# Altium schematic sheet Felini.SchDoc
size A0; SheetNumber: 1; SheetTotal: 1
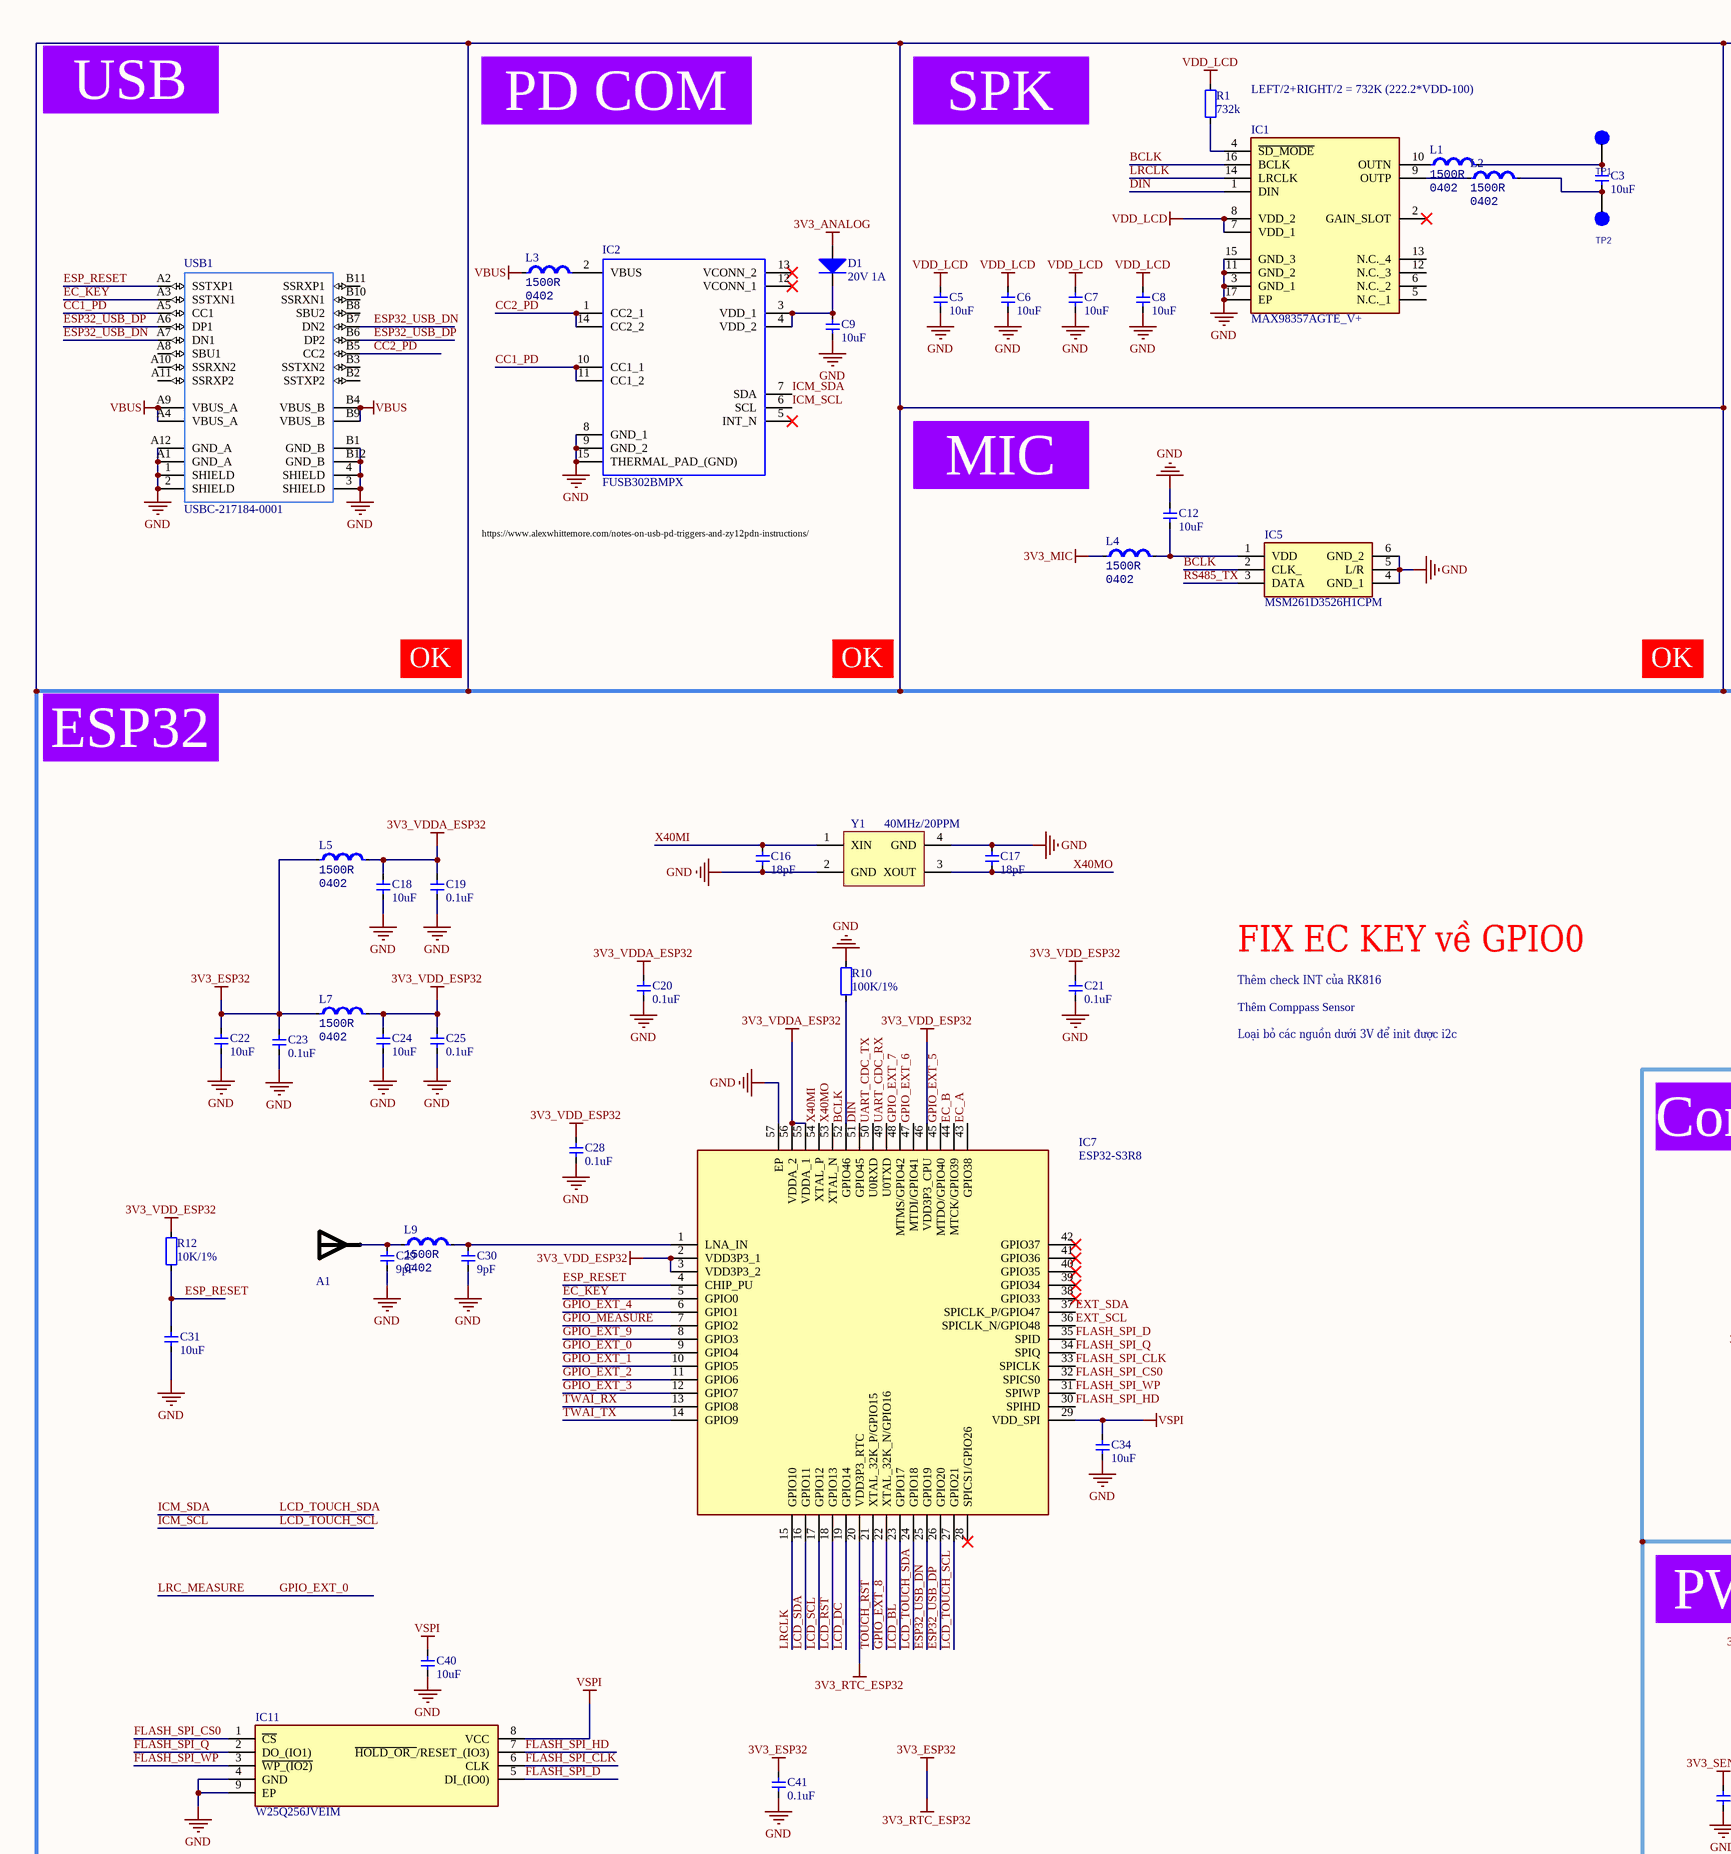
[diagram p0: Felini.SchDoc, top left]
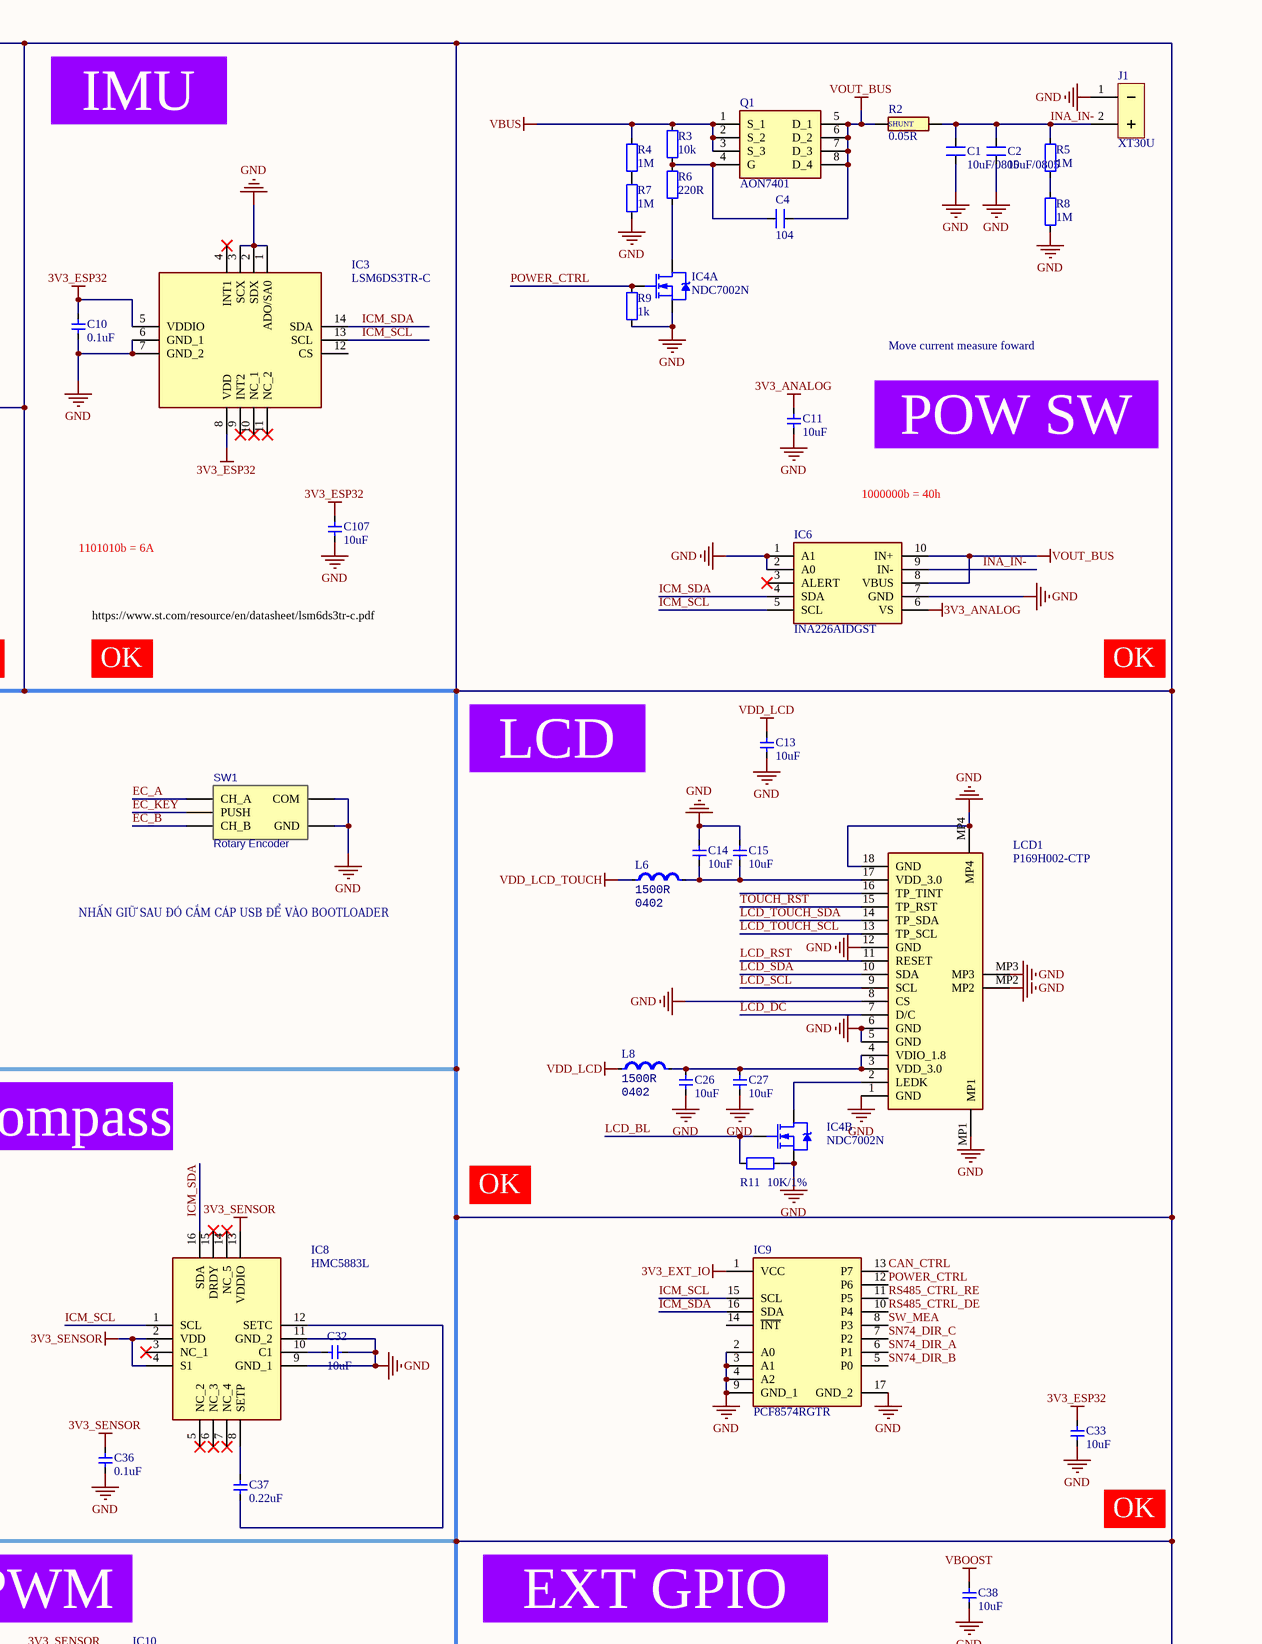
[diagram p1: Felini.SchDoc, top right]
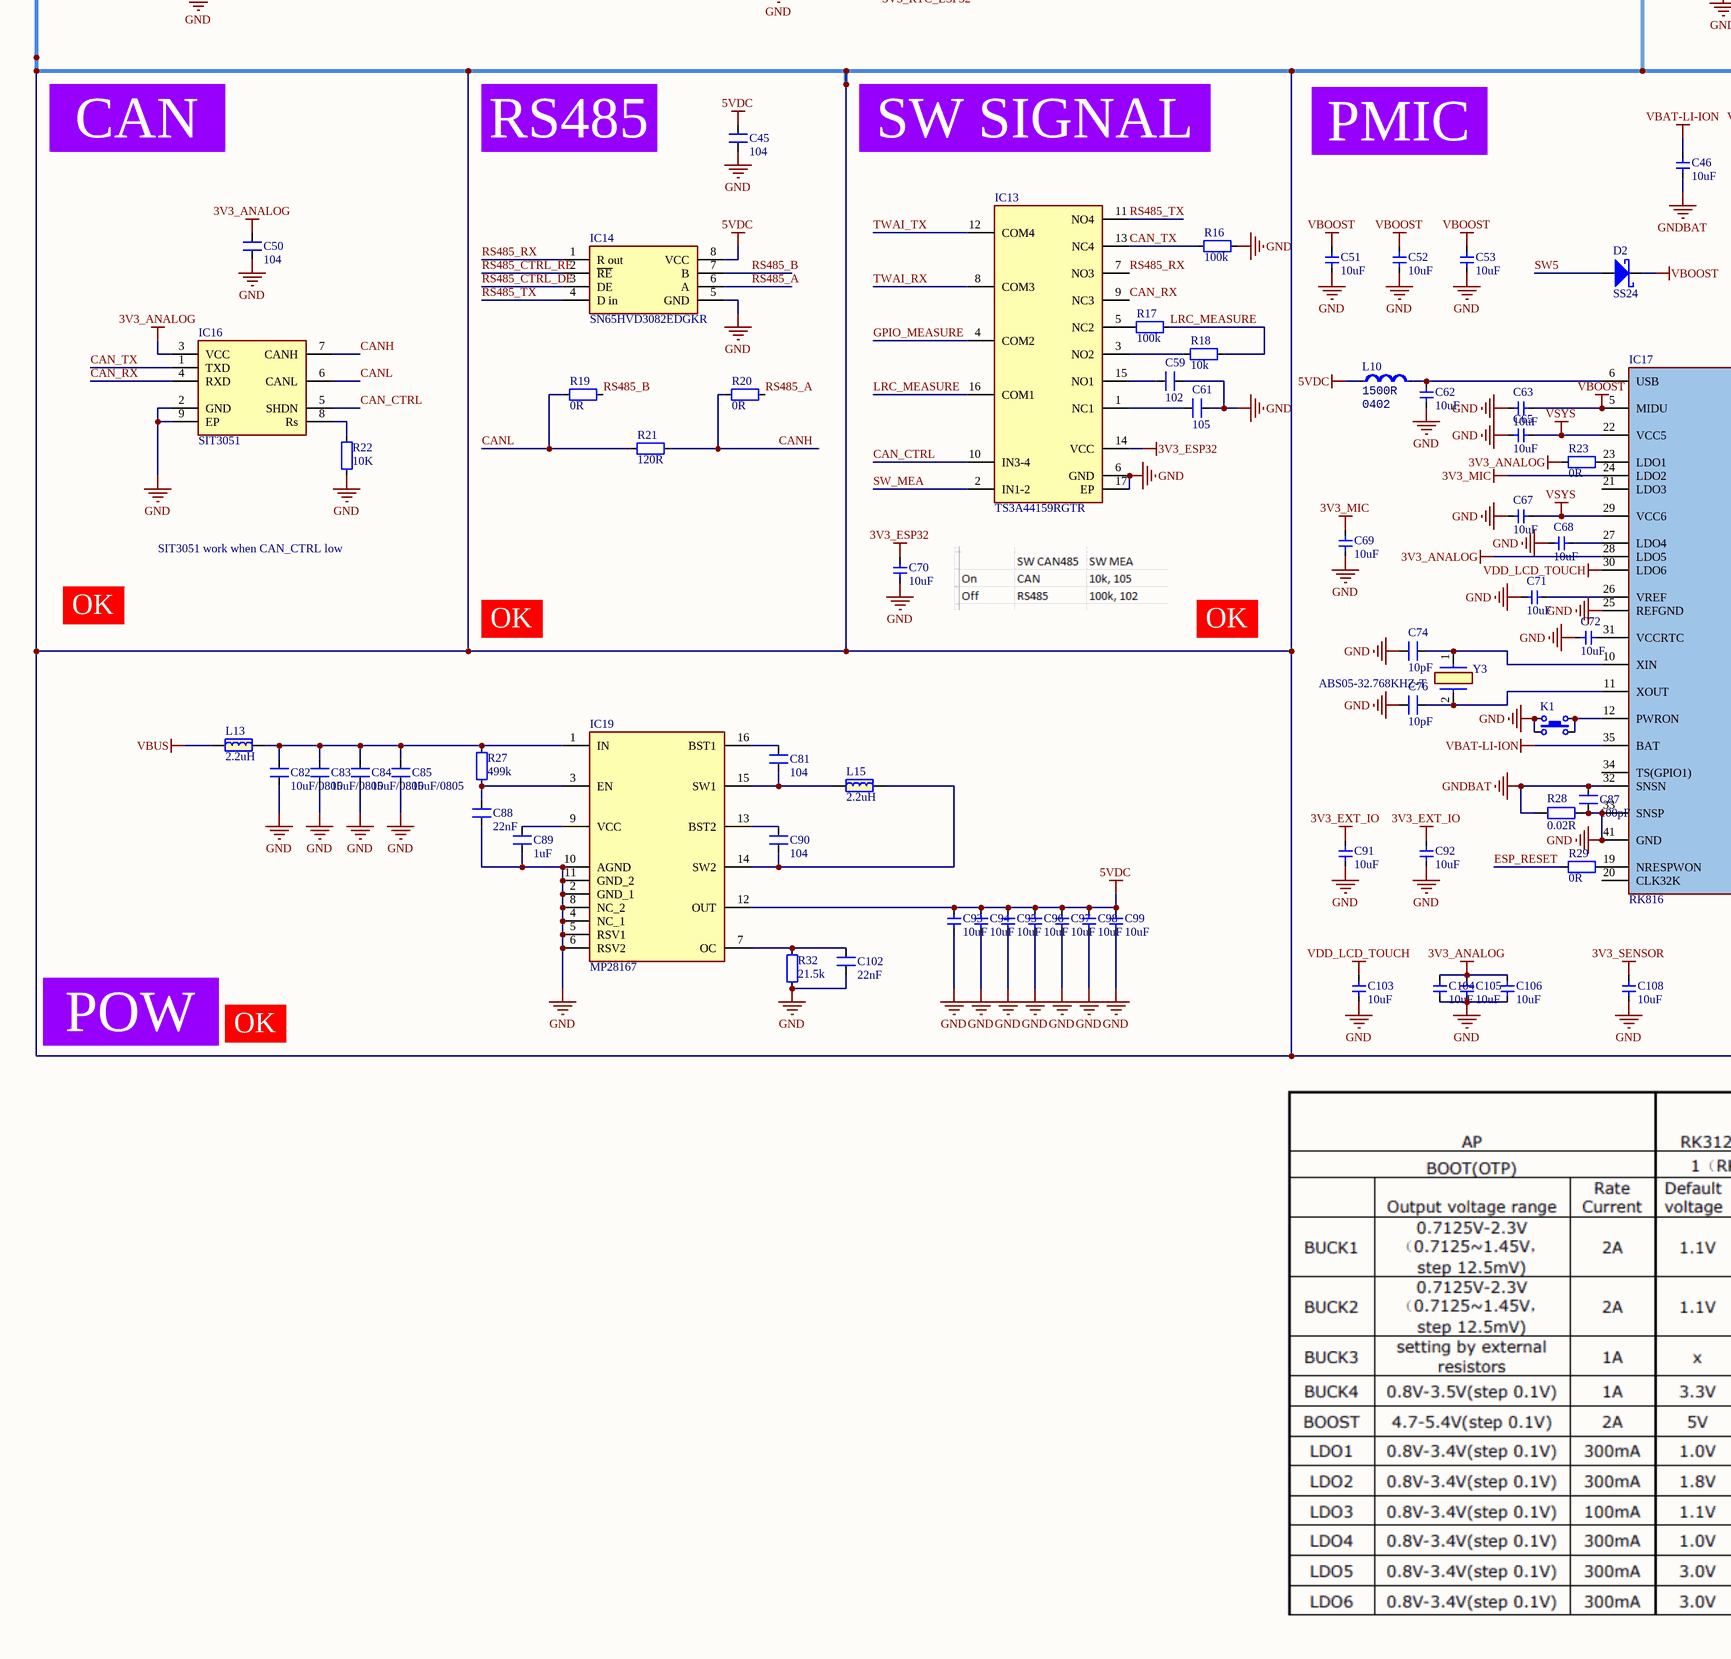
[diagram p2: Felini.SchDoc, bottom left]
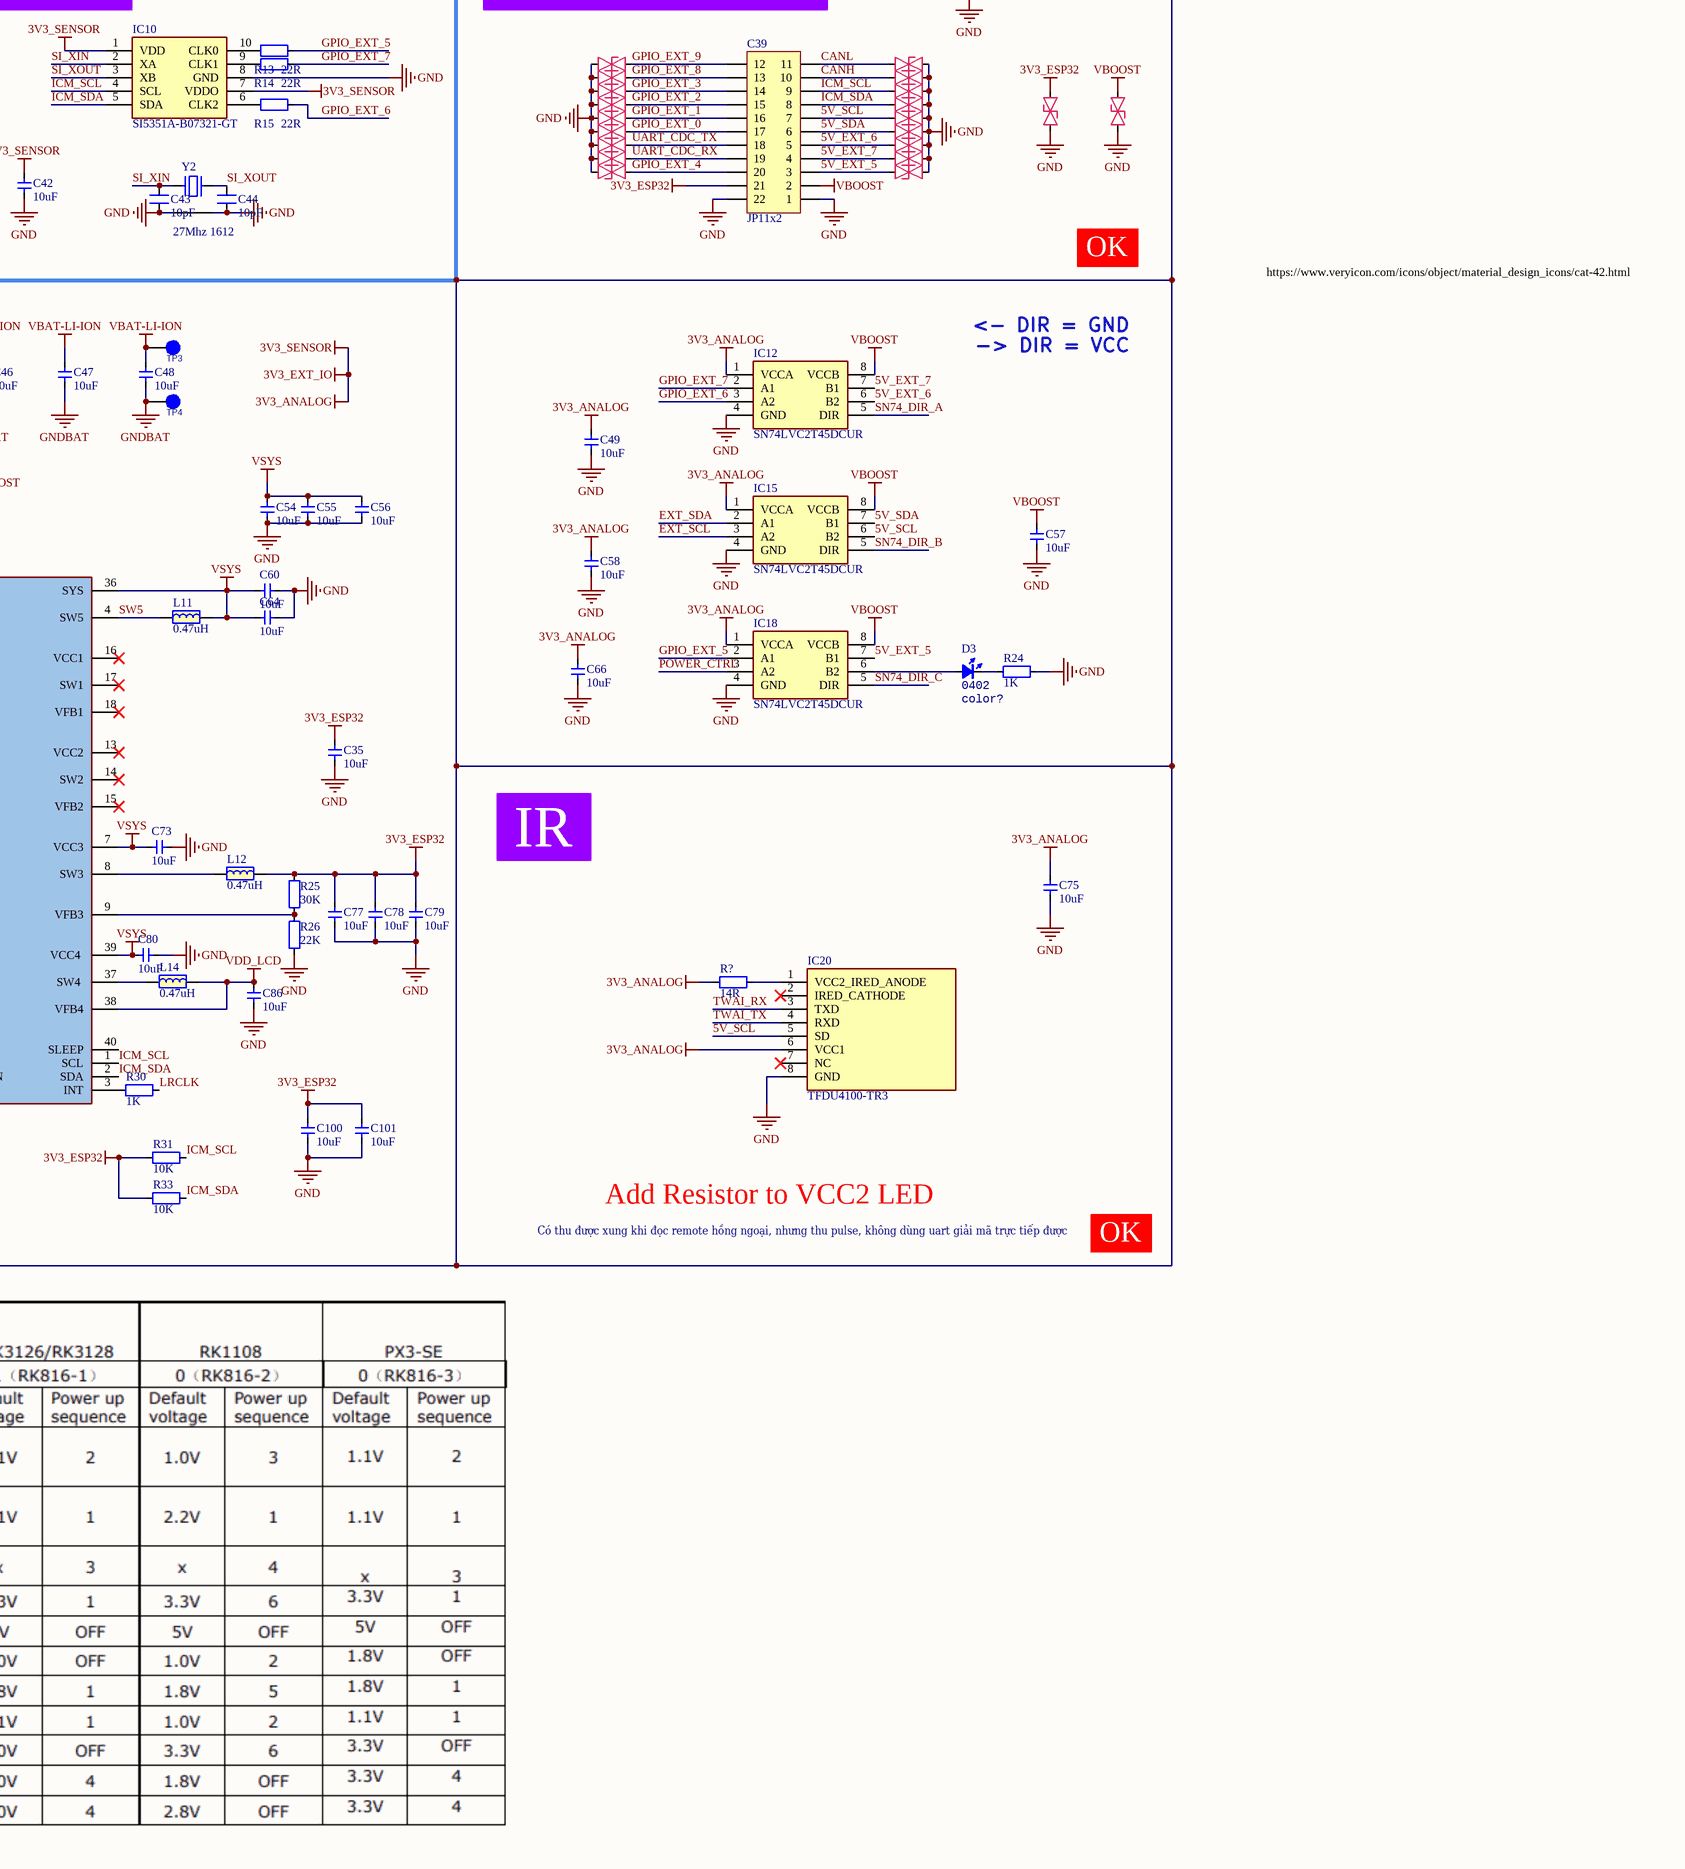
[diagram p3: Felini.SchDoc, bottom right]

## Parts
A1  RAINSUN  [ANT-Rainsun-AN5120]  (value not drawn)
C1  10uF/0805  [CM-0805T]
C2  10uF/0805  [CM-0805T]
C3  10uF  [CAP_0402_L]
C4  104  [SMD-0805-THIN]
C5  10uF  [CAP_0402]
C6  10uF  [CAP_0402]
C7  10uF  [CAP_0402]
C8  10uF  [CAP_0402]
C9  10uF  [CAP_0402]
C10  0.1uF  [CAP_0402]
C11  10uF  [CAP_0402]
C12  10uF  [CAP_0402]
C13  10uF  [CAP_0402]
C14  10uF  [CAP_0402]
C15  10uF  [CAP_0402]
C16  18pF  [CAP_0402]
C17  18pF  [CAP_0402]
C18  10uF  [CAP_0402]
C19  0.1uF  [CAP_0402]
C20  0.1uF  [CAP_0402]
C21  0.1uF  [CAP_0402]
C22  10uF  [CAP_0402]
C23  0.1uF  [CAP_0402]
C24  10uF  [CAP_0402]
C25  0.1uF  [CAP_0402]
C26  10uF  [CAP_0402]
C27  10uF  [CAP_0402]
C28  0.1uF  [CAP_0402]
C29  9pF  [CAP_0402]
C30  9pF  [CAP_0402]
C31  10uF  [CAP_0402]
C32  10uF  [CAP_0402]
C33  10uF  [CAP_0402_L]
C34  10uF  [CAP_0402]
C35  10uF  [CAP_0402]
C36  0.1uF  [CAP_0402]
C37  0.22uF  [CAP_0402]
C38  10uF  [CAP_0402_L]
C39  JP11x2  [JP11-D2C]
C40  10uF  [CAP_0402]
C41  0.1uF  [CAP_0402]
C42  10uF  [CAP_0402]
C43  10pF  [CAP_0402]
C44  10pF  [CAP_0402]
C45  104  [CAP_0402]
C46  10uF  [CAP_0402_L]
C47  10uF  [CAP_0402_L]
C48  10uF  [CAP_0402_L]
C49  10uF  [CAP_0402_L]
C50  104  [CAP_0402]
C51  10uF  [CAP_0402_L]
C52  10uF  [CAP_0402_L]
C53  10uF  [CAP_0402_L]
C54  10uF  [CAP_0402_L]
C55  10uF  [CAP_0402_L]
C56  10uF  [CAP_0402_L]
C57  10uF  [CAP_0402_L]
C58  10uF  [CAP_0402_L]
C59  102  [CAP_0402]
C60  10uF  [CAP_0402_L]
C61  105  [CAP_0402]
C62  10uF  [CAP_0402_L]
C63  10uF  [CAP_0402_L]
C64  10uF  [CAP_0402_L]
C65  10uF  [CAP_0402_L]
C66  10uF  [CAP_0402_L]
C67  10uF  [CAP_0402_L]
C68  10uF  [CAP_0402_L]
C69  10uF  [CAP_0402_L]
C70  10uF  [CAP_0402_L]
C71  10uF  [CAP_0402_L]
C72  10uF  [CAP_0402_L]
C73  10uF  [CAP_0402_L]
C74  10pF  [CAP_0402]
C75  10uF  [CAP_0402_L]
C76  10pF  [CAP_0402]
C77  10uF  [CAP_0402_L]
C78  10uF  [CAP_0402_L]
C79  10uF  [CAP_0402_L]
C80  10uF  [CAP_0402_L]
C81  104  [CAP_0402]
C82  10uF/0805  [CM-0805T]
C83  10uF/0805  [CM-0805T]
C84  10uF/0805  [CM-0805T]
C85  10uF/0805  [CM-0805T]
C86  10uF  [CAP_0402_L]
C87  100pF  [CAP_0402]
C88  22nF  [CAP_0402]
C89  1uF  [CAP_0402]
C90  104  [CAP_0402]
C91  10uF  [CAP_0402_L]
C92  10uF  [CAP_0402_L]
C93  10uF  [CAP_0402_L]
C94  10uF  [CAP_0402_L]
C95  10uF  [CAP_0402_L]
C96  10uF  [CAP_0402_L]
C97  10uF  [CAP_0402_L]
C98  10uF  [CAP_0402_L]
C99  10uF  [CAP_0402_L]
C100  10uF  [CAP_0402_L]
C101  10uF  [CAP_0402_L]
C102  22nF  [CAP_0402]
C103  10uF  [CAP_0402_L]
C104  10uF  [CAP_0402_L]
C105  10uF  [CAP_0402_L]
C106  10uF  [CAP_0402_L]
C107  10uF  [CAP_0402_L]
C108  10uF  [CAP_0402_L]
D1  20V 1A  [DFN1006D]
D2  SS24  [DIO-SOD323-SLIM]
D3  Type: 0402  [LED_0402_GREEN]  (hidden comment: color?)
ESD-1  ESD-0402  [ESD-0402]  (value not drawn)
ESD-2  ESD-0402  [ESD-0402]  (value not drawn)
ESD-3  ESD-0402  [ESD-0402]  (value not drawn)
ESD-4  ESD-0402  [ESD-0402]  (value not drawn)
ESD-5  ESD-0402  [ESD-0402]  (value not drawn)
ESD-6  ESD-0402  [ESD-0402]  (value not drawn)
ESD-7  ESD-0402  [ESD-0402]  (value not drawn)
ESD-8  ESD-0402  [ESD-0402]  (value not drawn)
ESD-9  ESD-0402  [ESD-0402]  (value not drawn)
ESD-10  ESD-0402  [ESD-0402]  (value not drawn)
ESD-11  ESD-0402  [ESD-0402]  (value not drawn)
ESD-12  ESD-0402  [ESD-0402]  (value not drawn)
ESD-13  ESD-0402  [ESD-0402]  (value not drawn)
ESD-14  ESD-0402  [ESD-0402]  (value not drawn)
ESD-15  ESD-0402  [ESD-0402]  (value not drawn)
ESD-16  ESD-0402  [ESD-0402]  (value not drawn)
ESD-17  ESD-0402  [ESD-0402]  (value not drawn)
ESD-18  ESD-0402  [ESD-0402]  (value not drawn)
ESD-19  ESD-0402  [ESD-0402]  (value not drawn)
ESD-20  ESD-0402  [ESD-0402]  (value not drawn)
IC1  MAX98357AGTE_V+  [QFN50P300X300X80-17N]
IC2  FUSB302BMPX  [QFN50P250X250X80-15N]
IC3  LSM6DS3TR-C  [LGA-14(2.5X3X0.86)]
IC4  NDC7002N  [SOT95P275X110-6N]  (parts A,B of 2)
IC5  MSM261D3526H1CPM  [MSM261D3526H1CPM]
IC6  INA226AIDGST  [SOP50P490X110-10N]
IC7  ESP32-S3R8  [QFN40P700X700X90-57N-D]
IC8  HMC5883L  [HMC5883L]
IC9  PCF8574RGTR  [QFN50P300X300X100-17N-D]
IC10  SI5351A-B07321-GT  [SOP50P490X110-10N]
IC11  W25Q256JVEIM  [SON127P800X600X80-9N-D]
IC12  SN74LVC2T45DCUR  [SOP50P310X90-8N]
IC13  TS3A44159RGTR  [QFN50P300X300X100-17N-D]
IC14  SN65HVD3082EDGKR  [SOP65P490X110-8N]
IC15  SN74LVC2T45DCUR  [SOP50P310X90-8N]
IC16  SIT3051  [SON65P300X300X100-9N]
IC17  RK816  [QFN40P500X500X90-41N]
IC18  SN74LVC2T45DCUR  [SOP50P310X90-8N]
IC19  MP28167  [MP28167]
IC20  TFDU4100-TR3  [TFDU4100TR3]
J1  XT30U  [XT30U-PCB-RA-CUTOUT]
K1  TACT 4P  [ButtonTACT_3.5*3.55_90]  (value not drawn)
L1  value 1500R  Type: 0402  [IND_0402Q]  (hidden comment: H0402)
L2  value 1500R  Type: 0402  [IND_0402Q]  (hidden comment: H0402)
L3  value 1500R  Type: 0402  [IND_0402Q]  (hidden comment: H0402)
L4  value 1500R  Type: 0402  [IND_0402Q]  (hidden comment: H0402)
L5  value 1500R  Type: 0402  [IND_0402Q]  (hidden comment: H0402)
L6  value 1500R  Type: 0402  [IND_0402Q]  (hidden comment: H0402)
L7  value 1500R  Type: 0402  [IND_0402Q]  (hidden comment: H0402)
L8  value 1500R  Type: 0402  [IND_0402Q]  (hidden comment: H0402)
L9  value 1500R  Type: 0402  [IND_0402Q]  (hidden comment: H0402)
L10  value 1500R  Type: 0402  [IND_0402Q]  (hidden comment: H0402)
L11  0.47uH  [2520-L]
L12  0.47uH  [2520-L]
L13  2.2uH  [2520-L]
L14  0.47uH  [2520-L]
L15  2.2uH  [2520-L]
LCD1  P169H002-CTP  [P169H002-CTP-TOP]
Q1  AON7401  [DFN_3X3_EP]
R1  732k  [RES_0402]
R2  0.05R  [RESC6432X88N]
R3  10k  [RES_0402]
R4  1M  [RES_0402]
R5  1M  [RES_0402]
R6  220R  [RES_0402]
R7  1M  [RES_0402]
R8  1M  [RES_0402]
R9  1k  [RES_0402]
R10  100K/1%  [RES_0402]
R11  10K/1%  [RES_0402]
R12  10K/1%  [RES_0402]
R13  22R  [RES_0402]
R14  22R  [RES_0402]
R15  22R  [RES_0402]
R16  100k  [RES_0402]
R17  100k  [RES_0402]
R18  10k  [RES_0402]
R19  0R  [RES_0402]
R20  0R  [RES_0402]
R21  120R  [RES_0402]
R22  10K  [RES_0402]
R23  0R  [RES_0402]
R24  1K  [RES_0402]
R25  30K  [RES_0402]
R26  22K  [RES_0402]
R27  499k  [RES_0402]
R28  0.02R  [RES-SMD-0805-Clean]
R29  0R  [RES_0402]
R30  1K  [RES_0402]
R31  10K  [RES_0402]
R32  21.5k  [RES_0402]
R33  10K  [RES_0402]
R?  14R  [RES_0402]
SW1  Rotary Encoder  [SIQ-02FVS3]
TP1  TPAD 0.8mm  [TH Test Pad 0.8mm]  (value not drawn)  (no BOM)
TP2  TPAD 0.8mm  [TH Test Pad 0.8mm]  (value not drawn)  (no BOM)
TP3  TPAD 0.8mm  [TH Test Pad 0.8mm]  (value not drawn)  (no BOM)
TP4  TPAD 0.8mm  [TH Test Pad 0.8mm]  (value not drawn)  (no BOM)
USB1  USBC-217184-0001  [Molex_217184-0001]
Y1  40MHz/20PPM  [XT-2520]
Y2  27Mhz 1612  [ECS1612MV080CNTR]
Y3  ABS05-32.768KHZ-T  [ABS0532768KHZT]

## Nets
3V3_ANALOG: C11.1 C36.2 C42.2 C49.2 C50.1 C58.2 C66.2 C75.2 C91.2 C92.2 C104.2 C105.2 C106.2 C108.2 D1.2(K) IC6.6(VS) IC8.2(VDD) IC8.4(S1) IC8.13(VDDIO) IC9.1(VCC) IC10.1(VDD) IC10.7(VDDO) IC12.1(VCCA) IC15.1(VCCA) IC16.3(VCC) IC17.28(LDO5) IC18.1(VCCA) IC20.6(VCC1) R23.2 R?.2  [also labelled 3V3_EXT_IO, 3V3_SENSOR]
3V3_ESP32: C10.2 C22.2 C23.2 C33.2 C35.2 C39.21 C41.2 C70.2 C77.1 C78.1 C79.1 C100.1 C101.1 C107.2 ESD-11.1 IC3.5(VDDIO) IC3.8(VDD) IC7.20(VDD3P3_RTC) IC13.14(VCC) L5.1 L7.1 L12.2 R25.2 R31.2 R33.2  [also labelled 3V3_RTC_ESP32]
3V3_MIC: C69.2 IC17.24(LDO2) L4.1
3V3_VDD_ESP32: C21.2 C24.2 C25.2 C28.2 IC7.2(VDD3P3_1) IC7.3(VDD3P3_2) IC7.46(VDD3P3_CPU) L7.2 R12.1
3V3_VDDA_ESP32: C18.2 C19.2 C20.2 IC7.55(VDDA_1) IC7.56(VDDA_2) L5.2
5VDC: C45.1 C93.2 C94.2 C95.2 C96.2 C97.2 C98.2 C99.2 IC14.8(VCC) IC19.12(OUT) L10.1
GND: C1.1 C2.1 C5.1 C6.1 C7.1 C8.1 C9.2 C10.1 C11.2 C12.2 C13.2 C14.1 C15.1 C16.1 C17.2 C18.1 C19.1 C20.1 C21.1 C22.1 C23.1 C24.1 C25.1 C26.2 C27.2 C28.1 C29.2 C30.2 C31.1 C32.1 C33.1 C34.2 C35.1 C36.1 C38.1 C39.1 C39.22 C40.2 C41.1 C42.1 C43.1 C44.1 C45.2 C49.1 C50.2 C51.1 C52.1 C53.1 C54.1 C55.1 C56.1 C57.1 C58.1 C59.2 C60.2 C61.2 C62.2 C63.1 C64.2 C65.1 C66.1 C67.1 C68.1 C69.1 C70.1 C71.1 C72.1 C73.2 C74.1 C75.1 C76.1 C77.2 C78.2 C79.2 C80.2 C82.1 C83.1 C84.1 C85.1 C86.1 C87.1 C88.2 C89.2 C91.1 C92.1 C93.1 C94.1 C95.1 C96.1 C97.1 C98.1 C99.1 C100.2 C101.2 C102.2 C103.1 C104.1 C105.1 C106.1 C107.1 C108.1 ESD-1.1 ESD-2.1 ESD-3.1 ESD-4.1 ESD-5.1 ESD-6.1 ESD-7.1 ESD-8.1 ESD-9.1 ESD-10.1 ESD-11.2 ESD-12.2 ESD-13.1 ESD-14.1 ESD-15.1 ESD-16.1 ESD-17.1 ESD-18.1 ESD-19.1 ESD-20.1 IC1.3(GND_1) IC1.11(GND_2) IC1.15(GND_3) IC1.17(EP) IC2.8(GND_1) IC2.9(GND_2) IC2.15(THERMAL_PAD_(GND)) IC3.1(ADO/SA0) IC3.2(SDX) IC3.3(SCX) IC3.6(GND_1) IC3.7(GND_2) IC4.2(S) IC4.5(S) IC5.4(GND_1) IC5.5(L/R) IC5.6(GND_2) IC6.1(A1) IC6.2(A0) IC6.7(GND) IC7.57(EP) IC8.9(GND_1) IC8.11(GND_2) IC9.2(A0) IC9.3(A1) IC9.4(A2) IC9.9(GND_1) IC9.17(GND_2) IC10.8(GND) IC11.4(GND) IC11.9(EP) IC12.4(GND) IC13.6(GND) IC13.17(EP) IC14.5(GND) IC15.4(GND) IC16.2(GND) IC16.9(EP) IC17.25(REFGND) IC17.33(SNSP) IC17.41(GND) IC18.4(GND) IC19.2(GND_1) IC19.4(NC_1) IC19.5(RSV1) IC19.6(RSV2) IC19.8(NC_2) IC19.10(AGND) IC19.11(GND_2) IC20.8(GND) J1.1(-) K1.1 K1.3 LCD1.1(GND) LCD1.5(GND) LCD1.6(GND) LCD1.8(CS) LCD1.12(GND) LCD1.18(GND) LCD1.MP1 LCD1.MP2 LCD1.MP3 LCD1.MP4 R7.1 R8.1 R9.2 R10.1 R11.1 R16.2 R22.1 R24.2 R26.1 R28.2 R32.1 SW1.3(COM) SW1.5(GND) USB1.1(SHIELD) USB1.2(SHIELD) USB1.3(SHIELD) USB1.4(SHIELD) USB1.A1(GND_A) USB1.A12(GND_A) USB1.B1(GND_B) USB1.B12(GND_B) Y1.2(GND) Y1.4(GND) Y2.2(GND) Y2.4(GND)
GNDBAT: C46.2 C47.2 C48.2 C87.2 IC17.32(SNSN) R28.1 TP4.1(TP)
VBAT-LI-ION: C46.1 C47.1 C48.1 IC17.35(BAT) TP3.1(TP)
VBOOST: C38.2 C39.2 C51.2 C52.2 C53.2 C57.2 C63.2 D2.2 ESD-12.1 IC12.8(VCCB) IC15.8(VCCB) IC17.5(MIDU) IC18.8(VCCB)
VBUS: L3.1 L13.1 Q1.1(S_1) Q1.2(S_2) Q1.3(S_3) R3.2 R4.2 USB1.A4(VBUS_A) USB1.A9(VBUS_A) USB1.B4(VBUS_B) USB1.B9(VBUS_B)
VDD_LCD: C5.2 C6.2 C7.2 C8.2 C13.1 C86.2 IC1.7(VDD_1) IC1.8(VDD_2) IC17.38(VFB4) L8.1 L14.2 R1.2
VDD_LCD_TOUCH: C103.2 IC17.30(LDO6) L6.1
VOUT_BUS: C4.2 IC6.8(VBUS) IC6.10(IN+) Q1.5(D_1) Q1.6(D_2) Q1.7(D_3) Q1.8(D_4) R2.1
VSPI: C34.1 C40.1 IC7.29(VDD_SPI) IC11.8(VCC)
VSYS: C54.2 C55.2 C56.2 C60.1 C64.1 C65.2 C67.2 C73.1 C80.1 IC17.7(VCC3) IC17.22(VCC5) IC17.29(VCC6) IC17.36(SYS) IC17.39(VCC4) L11.2
5V_EXT_5: C39.3 ESD-20.2 IC18.7(B1)
5V_EXT_6: C39.5 ESD-16.2 IC12.6(B2)
5V_EXT_7: C39.4 ESD-18.2 IC12.7(B1)
5V_SCL: C39.7 ESD-10.2 IC15.6(B2) IC20.5(SD)
5V_SDA: C39.6 ESD-14.2 IC15.7(B1)
BCLK: IC1.16(BCLK) IC5.2(CLK_) IC7.52(GPIO46) R10.2
CAN_CTRL: IC9.13(P7) IC13.10(IN3-4) IC16.5(SHDN)
CAN_RX: IC13.9(NC3) IC16.4(RXD)
CAN_TX: IC13.13(NC4) IC16.1(TXD) R16.1
CANH: C39.10 ESD-4.2 IC16.7(CANH) R20.1 R21.2
CANL: C39.11 ESD-2.2 IC16.6(CANL) R19.1 R21.1
CC1_PD: IC2.10(CC1_1) IC2.11(CC1_2) USB1.A5(CC1)
CC2_PD: IC2.1(CC2_1) IC2.14(CC2_2) USB1.B5(CC2)
DIN: IC1.1(DIN) IC7.51(GPIO45)
EC_A: IC7.43(GPIO38) SW1.1(CH_A)
EC_B: IC7.44(MTCK/GPIO39) SW1.4(CH_B)
EC_KEY: IC7.5(GPIO0) SW1.2(PUSH) USB1.A3(SSTXN1)
ESP32_USB_DN: IC7.25(GPIO19) USB1.A7(DN1) USB1.B7(DN2)
ESP32_USB_DP: IC7.26(GPIO20) USB1.A6(DP1) USB1.B6(DP2)
ESP_RESET: C31.2 IC7.4(CHIP_PU) R12.2 R29.2 USB1.A2(SSTXP1)
EXT_SCL: IC7.36(SPICLK_N/GPIO48) IC15.3(A2)
EXT_SDA: IC7.37(SPICLK_P/GPIO47) IC15.2(A1)
FLASH_SPI_CLK: IC7.33(SPICLK) IC11.6(CLK)
FLASH_SPI_CS0: IC7.32(SPICS0) IC11.1(~{CS})
FLASH_SPI_D: IC7.35(SPID) IC11.5(DI_(IO0))
FLASH_SPI_HD: IC7.30(SPIHD) IC11.7(~{HOLD_OR_}/RESET_(IO3))
FLASH_SPI_Q: IC7.34(SPIQ) IC11.2(DO_(IO1))
FLASH_SPI_WP: IC7.31(SPIWP) IC11.3(~{WP_(IO2)})
GPIO_EXT_0: C39.17 ESD-13.2 IC7.9(GPIO4) IC13.16(COM1) R17.2 R18.2  [also labelled LRC_MEASURE]
GPIO_EXT_1: C39.16 ESD-9.2 IC7.10(GPIO5)
GPIO_EXT_2: C39.15 ESD-7.2 IC7.11(GPIO6)
GPIO_EXT_3: C39.14 ESD-5.2 IC7.12(GPIO7)
GPIO_EXT_4: C39.20 ESD-19.2 IC7.6(GPIO1)
GPIO_EXT_5: IC7.45(MTDO/GPIO40) IC18.2(A1) R13.1
GPIO_EXT_6: IC7.47(MTDI/GPIO41) IC12.3(A2) R15.1
GPIO_EXT_7: IC7.48(MTMS/GPIO42) IC12.2(A1) R14.1
GPIO_EXT_8: C39.13 ESD-3.2 IC7.22(XTAL_32K_N/GPIO16)
GPIO_EXT_9: C39.12 ESD-1.2 IC7.8(GPIO3)
GPIO_MEASURE: IC7.7(GPIO2) IC13.4(COM2)
ICM_SCL: C39.9 ESD-6.2 IC2.6(SCL) IC3.13(SCL) IC6.5(SCL) IC7.27(GPIO21) IC8.1(SCL) IC9.15(SCL) IC10.4(SCL) IC17.1(SCL) LCD1.13(TP_SCL) R31.1  [also labelled LCD_TOUCH_SCL]
ICM_SDA: C39.8 ESD-8.2 IC2.7(SDA) IC3.14(SDA) IC6.4(SDA) IC7.24(GPIO18) IC8.16(SDA) IC9.16(SDA) IC10.5(SDA) IC17.2(SDA) LCD1.14(TP_SDA) R33.1  [also labelled LCD_TOUCH_SDA]
INA_IN-: C1.2 C2.2 IC6.9(IN-) J1.2(+) R2.2 R5.2
LCD_BL: IC4.1(G) IC7.23(GPIO17) R11.2
LCD_DC: IC7.19(GPIO14) LCD1.7(D/C)
LCD_RST: IC7.18(GPIO13) LCD1.11(RESET)
LCD_SCL: IC7.17(GPIO12) LCD1.9(SCL)
LCD_SDA: IC7.16(GPIO11) LCD1.10(SDA)
LRCLK: IC1.14(LRCLK) IC7.15(GPIO10) R30.1
POWER_CTRL: IC4.3(G) IC9.12(P6) IC18.3(A2) R9.1
RS485_A: IC14.6(A) R20.2
RS485_B: IC14.7(B) R19.2
RS485_CTRL_DE: IC9.10(P4) IC14.3(DE)
RS485_CTRL_RE: IC9.11(P5) IC14.2(~{RE})
RS485_RX: IC13.7(NO3) IC14.1(R_out)
RS485_TX: IC5.3(DATA) IC13.11(NO4) IC14.4(D_in)
SI_XIN: C43.2 IC10.2(XA) Y2.1
SI_XOUT: C44.2 IC10.3(XB) Y2.3
SN74_DIR_A: IC9.6(P1) IC12.5(DIR)
SN74_DIR_B: IC9.5(P0) IC15.5(DIR)
SN74_DIR_C: IC9.7(P2) IC18.5(DIR)
SW5: D2.1 IC17.4(SW5) L11.1
SW_MEA: IC9.8(P3) IC13.2(IN1-2)
TOUCH_RST: IC7.21(XTAL_32K_P/GPIO15) LCD1.15(TP_RST)
TWAI_RX: IC7.13(GPIO8) IC13.8(COM3) IC20.3(TXD)
TWAI_TX: IC7.14(GPIO9) IC13.12(COM4) IC20.4(RXD)
UART_CDC_RX: C39.19 ESD-17.2 IC7.49(U0TXD)
UART_CDC_TX: C39.18 ESD-15.2 IC7.50(U0RXD)
X40MI: C16.2 IC7.54(XTAL_P) Y1.1(XIN)
X40MO: C17.1 IC7.53(XTAL_N) Y1.3(XOUT)
NetA1_1: A1.1 C29.1 L9.1
NetC3_1: C3.1 L1.2 TP1.1(TP)
NetC3_2: C3.2 L2.2 TP2.1(TP)
NetC4_1: C4.1 Q1.4(G) R3.1 R6.2
NetC9_1: C9.1 D1.1(A) IC2.3(VDD_1) IC2.4(VDD_2)
NetC12_1: C12.1 IC5.1(VDD) L4.2
NetC14_2: C14.2 C15.2 L6.2 LCD1.17(VDD_3.0)
NetC26_1: C26.1 C27.1 L8.2 LCD1.3(VDD_3.0) LCD1.4(VDIO_1.8)
NetC30_1: C30.1 IC7.1(LNA_IN) L9.2
NetC32_2: C32.2 IC8.10(C1)
NetC37_1: C37.1 IC8.12(SETC)
NetC37_2: C37.2 IC8.8(SETP)
NetC59_1: C59.1 IC13.15(NO1)
NetC61_1: C61.1 IC13.1(NC1)
NetC62_1: C62.1 IC17.6(USB) L10.2
NetC68_2: C68.2 IC17.27(LDO4)
NetC71_2: C71.2 IC17.26(VREF)
NetC72_2: C72.2 IC17.31(VCCRTC)
NetC74_2: C74.2 IC17.10(XIN) Y3.1
NetC76_2: C76.2 IC17.11(XOUT) Y3.2
NetC81_1: C81.1 IC19.16(BST1)
NetC81_2: C81.2 IC19.15(SW1) L15.1
NetC82_2: C82.2 C83.2 C84.2 C85.2 IC19.1(IN) L13.2 R27.2
NetC88_1: C88.1 IC19.3(EN) R27.1
NetC89_1: C89.1 IC19.9(VCC)
NetC90_1: C90.1 IC19.13(BST2)
NetC90_2: C90.2 IC19.14(SW2) L15.2
NetC102_1: C102.1 IC19.7(OC) R32.2
NetD3_1: D3.1(A) IC18.6(B2)
NetD3_2: D3.2(K) R24.1
NetIC1_4: IC1.4(~{SD_MODE}) R1.1
NetIC1_9: IC1.9(OUTP) L2.1
NetIC1_10: IC1.10(OUTN) L1.1
NetIC2_2: IC2.2(VBUS) L3.2
NetIC4_4: IC4.4(D) R6.1
NetIC4_6: IC4.6(D) LCD1.2(LEDK)
NetIC10_6: IC10.6(CLK2) R15.2
NetIC10_9: IC10.9(CLK1) R14.2
NetIC10_10: IC10.10(CLK0) R13.2
NetIC13_3: IC13.3(NO2) R18.1
NetIC13_5: IC13.5(NC2) R17.1
NetIC16_8: IC16.8(Rs) R22.2
NetIC17_3: IC17.3(INT) R30.2
NetIC17_8: IC17.8(SW3) L12.1
NetIC17_9: IC17.9(VFB3) R25.1 R26.2
NetIC17_12: IC17.12(PWRON) K1.2 K1.4
NetIC17_19: IC17.19(NRESPWON) R29.1
NetIC17_23: IC17.23(LDO1) R23.1
NetIC17_37: IC17.37(SW4) L14.1
NetIC20_1: IC20.1(VCC2_IRED_ANODE) R?.1
NetR4_1: R4.1 R7.2
NetR5_1: R5.1 R8.2

Not connected (* = marked no-connect by the designer): IC1 2(GAIN_SLOT)* 5(N.C._1) 6(N.C._2) 12(N.C._3) 13(N.C._4); IC2 5(INT_N)* 12(VCONN_1)* 13(VCONN_2)*; IC3 4(INT1)* 9(INT2)* 10(NC_1)* 11(NC_2)* 12(CS); IC6 3(ALERT)*; IC7 28(SPICS1/GPIO26)* 38(GPIO33)* 39(GPIO34)* 40(GPIO35)* 41(GPIO36)* 42(GPIO37)*; IC8 3(NC_1)* 5(NC_2)* 6(NC_3)* 7(NC_4)* 14(NC_5)* 15(DRDY)*; IC9 14(~{INT}); IC17 13(VCC2)* 14(SW2)* 15(VFB2)* 16(VCC1)* 17(SW1)* 18(VFB1)* 20(CLK32K) 21(LDO3_) 34(TS(GPIO1)) 40(SLEEP); IC20 2(IRED_CATHODE)* 7(NC)*; LCD1 16(TP_TINT); USB1 A8(SBU1) A10(SSRXN2) A11(SSRXP2) B2(SSTXP2) B3(SSTXN2) B8(SBU2) B10(SSRXN1) B11(SSRXP1)

## Notes on the sheet
- USB
- LEFT/2+RIGHT/2 = 732K (222.2*VDD-100)
- PD COM
- SPK
- IMU
- Move current measure foward
- POW SW
- MIC
- 1000000b = 40h
- https://www.alexwhittemore.com/notes-on-usb-pd-triggers-and-zy12pdn-instructions/
- 1101010b = 6A
- https://www.st.com/resource/en/datasheet/lsm6ds3tr-c.pdf
- OK
- ESP32
- LCD
- NHẤN GIỮ SAU ĐÓ CẮM CÁP USB ĐỂ VÀO BOOTLOADER
- FIX EC KEY về GPIO0
- Thêm check INT của RK816
- Thêm Comppass Sensor
- Loại bỏ các nguồn dưới 3V để init được i2c
- Compass
- (near IC10) PWM
- EXT GPIO
- https://www.veryicon.com/icons/object/material_design_icons/cat-42.html
- CAN
- RS485
- SW SIGNAL
- PMIC
- SIT3051 work when CAN_CTRL low
- IR
- POW
- Có thu được xung khi đọc remote hồng ngoại, nhưng thu pulse, không dùng uart giải mã trực tiếp được
- Add Resistor to VCC2 LED
- (in symbol PA2512FKF7W0R005E) SHUNT

## Library data of the parts
A1 = ANT-Rainsun-AP5120
C1 C2 C4 C43-C45 C50 C59 C61 C74 C76 C81-C85 C87-C90 C102 = CM: Cap SMD; Value: 103
C3 C5-C38 C40-C42 C46-C49 C51-C58 C60 C62-C73 C75 C77-C80 C86 C91-C101 C103-C108 = C_0402: Capacitor; Value: 0.1u
C39 = JP11x2: WR-PHD 2.54 mm Dual Socket Header; Manufacturer: W¨¹rth Elektronik eiSos GmbH; partNo: 61302221821; ComponentLink1 Description: Manufacturer; ComponentLink2 Description: Datasheet; NoPins: 22; Created Date: 29 March 2013; ComponentLink1URL: http://www.we-online.com; ComponentLink2URL: http://katalog.we-online.de/em/datasheet/6130xx21821.pdf; Created by: Karrer Zheng
D1 = PMEG2010BELD: DFN1006D-2; MPN: 1N4148; Solder: WAVE; CompanyID: VT-00238; Value: 75V/150MA
D2 = Diode Schottky: Part Number: LED 3 ly Single Colour; Pricing: *
D3 = LED_0402: LED; Value: color?
ESD-1-ESD-20 = ESD-0402: ESD
IC1 = MAX98357AGTE_V+: Integrated Circuit; Manufacturer_Name: Analog Devices; Manufacturer_Part_Number: MAX98357AGTE/V+; Datasheet Link: https://pdfserv.maximintegrated.com/en/ds/MAX98357A-MAX98357B.pdf; Height: 0.8mm; Mouser Part Number: 700-MAX98357AGTE/V; Mouser Price/Stock: https://www.mouser.co.uk/ProductDetail/Maxim-Integrated/MAX98357AGTE-V%2b?qs=ihlaDWZG8x5wW5pNUIxNEQ%3D%3D
IC2 = FUSB302B11MPX: Integrated Circuit; Manufacturer_Name: onsemi; Datasheet Link: http://www.farnell.com/datasheets/2313408.pdf; Height: 0.8mm; Manufacturer_Part_Number: FUSB302B11MPX; Mouser Part Number: 512-FUSB302B11MPX; Mouser Price/Stock: https://www.mouser.co.uk/ProductDetail/onsemi-Fairchild/FUSB302B11MPX?qs=jFK2DQXLaBwFFZq6iARIyw%3D%3D; Arrow Part Number: FUSB302B11MPX; Arrow Price/Stock: https://www.arrow.com/en/products/fusb302b11mpx/on-semiconductor?region=nac
IC3 = LSM6DS3TR-C: Integrated Circuit; Manufacturer_Name: STMicroelectronics; Datasheet Link: http://www.st.com/resource/en/datasheet/lsm6ds3tr-c.pdf; Manufacturer_Part_Number: LSM6DS3TR-C; Mouser Part Number: 511-LSM6DS3TR-C; Mouser Price/Stock: https://www.mouser.co.uk/ProductDetail/STMicroelectronics/LSM6DS3TR-C?qs=u4fy%2FsgLU9NHwPlhP3LTBw%3D%3D; Arrow Part Number: LSM6DS3TR-C; Arrow Price/Stock: https://www.arrow.com/en/products/lsm6ds3tr-c/stmicroelectronics?region=nac
IC4 = NDC7002N: Integrated Circuit; Manufacturer_Name: onsemi; Datasheet Link: https://datasheet.datasheetarchive.com/originals/distributors/Datasheets_SAMA/c4ad52bc077eca58f05c34eb905042cc.pdf; Height: 1.1mm; Manufacturer_Part_Number: NDC7002N; Mouser Part Number: 512-NDC7002N; Mouser Price/Stock: https://www.mouser.co.uk/ProductDetail/ON-Semiconductor-Fairchild/NDC7002N?qs=mdiO5HdF0KhkGcAvmkUMAw%3D%3D; Arrow Part Number: NDC7002N; Arrow Price/Stock: https://www.arrow.com/en/products/ndc7002n/on-semiconductor?region=nac
IC5 = MSM261D3526H1CPM: Integrated Circuit; Manufacturer_Name: MEMSIC; Datasheet Link: https://www.denovocn.com/sites/default/files/MSM261D3526H1CPM.pdf; Height: 1.09mm; Manufacturer_Part_Number: MSM261D3526H1CPM
IC6 = INA226AIDGST: Integrated Circuit; Manufacturer_Name: Texas Instruments; Datasheet Link: http://www.ti.com/lit/gpn/ina226; Height: 1.1mm; Manufacturer_Part_Number: INA226AIDGST; Mouser Part Number: 595-INA226AIDGST; Mouser Price/Stock: https://www.mouser.co.uk/ProductDetail/Texas-Instruments/INA226AIDGST?qs=tQG3bEuiOZB3Ay2BJOjnEQ%3D%3D; Arrow Part Number: INA226AIDGST; Arrow Price/Stock: https://www.arrow.com/en/products/ina226aidgst/texas-instruments?region=nac
IC7 = ESP32-S3R8: Integrated Circuit; Manufacturer_Name: Espressif Systems; Datasheet Link: https://www.espressif.com/sites/default/files/documentation/esp32-s3_datasheet_en.pdf; Height: 0.9mm; Manufacturer_Part_Number: ESP32-S3R8; Mouser Part Number: 356-ESP32-S3R8; Mouser Price/Stock: https://www.mouser.co.uk/ProductDetail/Espressif-Systems/ESP32-S3R8?qs=Rp5uXu7WBW%252Bto4RqH8CMng%3D%3D
IC8 = HMC5883L: Integrated Circuit; Manufacturer_Name: Honeywell; Datasheet Link: http://www.farnell.com/datasheets/1683374.pdf; Height: 0.9mm; Manufacturer_Part_Number: HMC5883L
IC9 = PCF8574RGTR: Integrated Circuit; Manufacturer_Name: Texas Instruments; Datasheet Link: http://www.ti.com/lit/ds/symlink/pcf8574.pdf; Height: 1mm; Manufacturer_Part_Number: PCF8574RGTR; Mouser Part Number: 595-PCF8574RGTR; Mouser Price/Stock: https://www.mouser.co.uk/ProductDetail/Texas-Instruments/PCF8574RGTR?qs=aEuGZpxfbxU4RAQYhLgLXA%3D%3D; Arrow Part Number: PCF8574RGTR; Arrow Price/Stock: https://www.arrow.com/en/products/pcf8574rgtr/texas-instruments?region=nac
IC10 = SI5351A-B07321-GT: Integrated Circuit; Manufacturer_Name: Silicon Labs; Datasheet Link: https://www.silabs.com/documents/public/data-sheets/Si5351-B.pdf; Height: 1.1mm; Manufacturer_Part_Number: SI5351A-B07321-GT; Mouser Part Number: 634-SI5351A-B07321GT; Mouser Price/Stock: https://www.mouser.co.uk/ProductDetail/Silicon-Labs/SI5351A-B07321-GT?qs=r5DSvlrkXmIww5j7XgJhrw%3D%3D
IC11 = W25Q256JVEIM: Integrated Circuit; Manufacturer_Name: Winbond; Datasheet Link: https://www.winbond.com/hq/search-resource-file.jsp?partNo=W25Q256JVEIM&type=datasheet; Height: 0.8mm; Manufacturer_Part_Number: W25Q256JVEIM; Mouser Part Number: 454-W25Q256JVEIM; Mouser Price/Stock: https://www.mouser.co.uk/ProductDetail/Winbond/W25Q256JVEIM?qs=qSfuJ%252Bfl%2Fd7qz5vdXYnZ2g%3D%3D; Arrow Part Number: W25Q256JVEIM; Arrow Price/Stock: https://www.arrow.com/en/products/w25q256jveim/winbond-electronics?region=nac
IC12 IC15 IC18 = SN74LVC2T45DCUR: Integrated Circuit; Manufacturer_Name: Texas Instruments; Datasheet Link: http://www.ti.com/lit/gpn/sn74lvc2t45; Height: 0.9mm; Manufacturer_Part_Number: SN74LVC2T45DCUR; Mouser Part Number: 595-SN74LVC2T45DCUR; Mouser Price/Stock: https://www.mouser.co.uk/ProductDetail/Texas-Instruments/SN74LVC2T45DCUR?qs=0smPjiIwnfIdG9vxyJHBdA%3D%3D; Arrow Part Number: SN74LVC2T45DCUR; Arrow Price/Stock: https://www.arrow.com/en/products/sn74lvc2t45dcur/texas-instruments?region=nac
IC13 = TS3A44159RGTR: Integrated Circuit; Manufacturer_Name: Texas Instruments; Datasheet Link: http://www.ti.com/lit/gpn/ts3a44159; Height: 1mm; Manufacturer_Part_Number: TS3A44159RGTR; Mouser Part Number: 595-TS3A44159RGTR; Mouser Price/Stock: https://www.mouser.co.uk/ProductDetail/Texas-Instruments/TS3A44159RGTR?qs=0OHPnBYoB%2FlQVATyn3CeUQ%3D%3D; Arrow Part Number: TS3A44159RGTR; Arrow Price/Stock: https://www.arrow.com/en/products/ts3a44159rgtr/texas-instruments?region=nac
IC14 = SN65HVD3082EDGKR: Integrated Circuit; Manufacturer_Name: Texas Instruments; Datasheet Link: http://www.ti.com/general/docs/lit/getliterature.tsp?genericPartNumber=sn65hvd3082e&fileType=pdf; Height: 1.1mm; Manufacturer_Part_Number: SN65HVD3082EDGKR; Mouser Part Number: 595-SN65HVD3082EDGKR; Mouser Price/Stock: https://www.mouser.co.uk/ProductDetail/Texas-Instruments/SN65HVD3082EDGKR?qs=QViXGNcIEAvmX2xpQO6kog%3D%3D; Arrow Part Number: SN65HVD3082EDGKR; Arrow Price/Stock: https://www.arrow.com/en/products/sn65hvd3082edgkr/texas-instruments?region=nac
IC16 = SIT3051: https://v1.cecdn.yun300.cn/100001_2009295029/SIT3051-datasheet-V1.0-en.pdf; Manufacturer_Name: NXP; Manufacturer_Part_Number: TJA1044VTKZ; Datasheet Link: http://www.nxp.com/docs/en/data-sheet/TJA1044V.pdf; Height: 1mm; Mouser Part Number: 771-TJA1044VTKZ; Mouser Price/Stock: https://www.mouser.co.uk/ProductDetail/NXP-Semiconductors/TJA1044VTKZ?qs=wUXugUrL1qx6DvcsX%252BFKdw%3D%3D; Arrow Part Number: TJA1044VTKZ; Arrow Price/Stock: https://www.arrow.com/en/products/tja1044vtkz/nxp-semiconductors?region=nac
IC17 = RK816: https://rockchip.fr/RK816%20datasheet%20V1.3.pdf; Manufacturer_Name: X-Powers; Manufacturer_Part_Number: AXP192; Datasheet Link: http://www.x-powers.com/en.php/Info/down/id/50; Height: 0.92mm
IC19 = MP28167: Integrated Circuit; Manufacturer_Name: Monolithic Power Systems (MPS); Datasheet Link: https://www.monolithicpower.com/en/documentview/productdocument/index/version/2/document_type/Datasheet/lang/en/sku/MP28167GQ/document_id/4000/; Height: 1mm; Manufacturer_Part_Number: MP28167
IC20 = TFDU4100-TR3: Integrated Circuit; Manufacturer_Name: Vishay; Datasheet Link: https://www.mouser.com/datasheet/2/427/tfdu4101-240267.pdf; Height: 4.2mm; Manufacturer_Part_Number: TFDU4100-TR3; Mouser Part Number: 782-TFDU4100; Mouser Price/Stock: https://www.mouser.co.uk/ProductDetail/Vishay-Semiconductors/TFDU4100-TR3?qs=oNDV51lhjEOVE6uYu7jcDQ%3D%3D
K1 = ButtonTACT: Button; value: 3.4x3.5; type: TACT 4P
L1-L10 = Ind_0402: Inductor; Specification: ±5% 100mA; Manufacturer: *
L11-L15 = L-2520: Inductor
LCD1 = P169H002-CTP: Manufacturer_Name: Molex; Manufacturer_Part_Number: 52745-1897; Datasheet Link: https://www.molex.com/pdm_docs/sd/527451897_sd.pdf; Height: 2.2mm; Mouser Part Number: 538-52745-1897; Mouser Price/Stock: https://www.mouser.co.uk/ProductDetail/Molex/52745-1897?qs=nDwhpid8gJadnFllaLBjSg%3D%3D
Q1 = AON7401: MOSFET (P-Channel); Manufacturer_Name: Alpha & Omega Semiconductors; Datasheet Link: http://aosmd.com/res/data_sheets/AON7401.pdf; Manufacturer_Part_Number: AON7401; Arrow Part Number: AON7401; Arrow Price/Stock: https://www.arrow.com/en/products/aon7401/alpha-and-omega-semiconductor
R1 R3-R12 R16-R27 R29-R33 R? = R-0402: Resistor; Value: 22R
R2 = PA2512FKF7W0R005E: Resistor; Manufacturer_Name: KEMET; Datasheet Link: https://datasheet.datasheetarchive.com/originals/distributors/Datasheets_SAMA/584704d41e6290df1722e1342324bc6a.pdf; Height: 0.88mm; Manufacturer_Part_Number: PA2512FKF7W0R005E; Mouser Part Number: 603-PA2512FKF7W0R005; Mouser Price/Stock: https://www.mouser.co.uk/ProductDetail/YAGEO/PA2512FKF7W0R005E?qs=kUzwwg2uGjVVrHetxt8Trw%3D%3D; Arrow Part Number: PA2512FKF7W0R005E; Arrow Price/Stock: https://www.arrow.com/en/products/pa2512fkf7w0r005e/yageo
R13-R15 = R-0402: Resistor; Value: 22R
R28 = R: Resistor R1/4W
SW1 = Rotary Encoder: SIQ-02FVS3; BOM_Manufacturer: ALPSALPINE; BOM_Manufacturer Part: EC11E1534443; Contributor: LCSC; BOM_Supplier: LCSC; BOM_Supplier Part: C1322543; BOM_JLCPCB Part Class: Extended Part; spicePre: S; spiceSymbolName: EC11E1534443
TP1-TP4 = TP 0.8mm: PCB TEST PAD TH 0.8mm; Manufacturer part #: *; DigiKey: *; Indications: *; Value: *; Modified by: *; Manufacturer: *; Created by: eteofilo; Creation date: 22-Feb-2018
USB1 = USBC-217184-0001: USB-C (USB TYPE-C) USB 3.2 Gen 2 (USB 3.1 Gen 2, Superspeed + (USB 3.1)) Receptacle Connector 24 Position Surface Mount, Right Angle; Through Hole; MP: USB4080-03-A; MF: Global Connector Technology; Package: None; Check_prices: https://www.snapeda.com/parts/USB4080-03-A/Global+Connector+Technology/view-part/?ref=eda; Value: *; Availability: In Stock; SnapEDA_Link: https://www.snapeda.com/parts/USB4080-03-A/Global+Connector+Technology/view-part/?ref=snap; Purchase-URL: https://pricing.snapeda.com/search/part/USB4080-03-A/?ref=eda; Price: None
Y1 = XT-4Pin: XT-2520; MF: ECS International; MP: ECS-3225S30-240-EN-TR; Package: SMD-6 ECS International; Price: 0.75 USD; Availability: Unavailable; Value: *
Y2 = XT-1612MV: Crystal or Oscillator; Manufacturer_Name: ECS; Manufacturer_Part_Number: ECS-1612MV-080-CN-TR; Datasheet Link: https://www.arrow.com/en/products/ecs-1612mv-080-cn-tr/ecs-international; Height: 0.7mm; Mouser Part Number: 520-1612MV-080-CNT; Mouser Price/Stock: https://www.mouser.co.uk/ProductDetail/ECS/ECS-1612MV-080-CN-TR?qs=MLItCLRbWswg5aTynjLSEQ%3D%3D; Arrow Part Number: ECS-1612MV-080-CN-TR; Arrow Price/Stock: https://www.arrow.com/en/products/ecs-1612mv-080-cn-tr/ecs-international
Y3 = ABS05-32.768KHZ-T: Crystal or Oscillator; Manufacturer_Name: ABRACON; Datasheet Link: https://abracon.com/Resonators/ABS05.pdf; Height: 0.5mm; Manufacturer_Part_Number: ABS05-32.768KHZ-T; Mouser Part Number: 815-ABS05-32.768K-T; Mouser Price/Stock: https://www.mouser.co.uk/ProductDetail/ABRACON/ABS05-32.768KHZ-T?qs=Pyu0ZBy%2FIJZ5hxIXB%2FLU5A%3D%3D; Arrow Part Number: ABS05-32.768KHZ-T; Arrow Price/Stock: https://www.arrow.com/en/products/abs05-32.768khz-t/abracon?region=europe